# Altium schematic sheet SW_S_5.SchDoc
size Tabloid
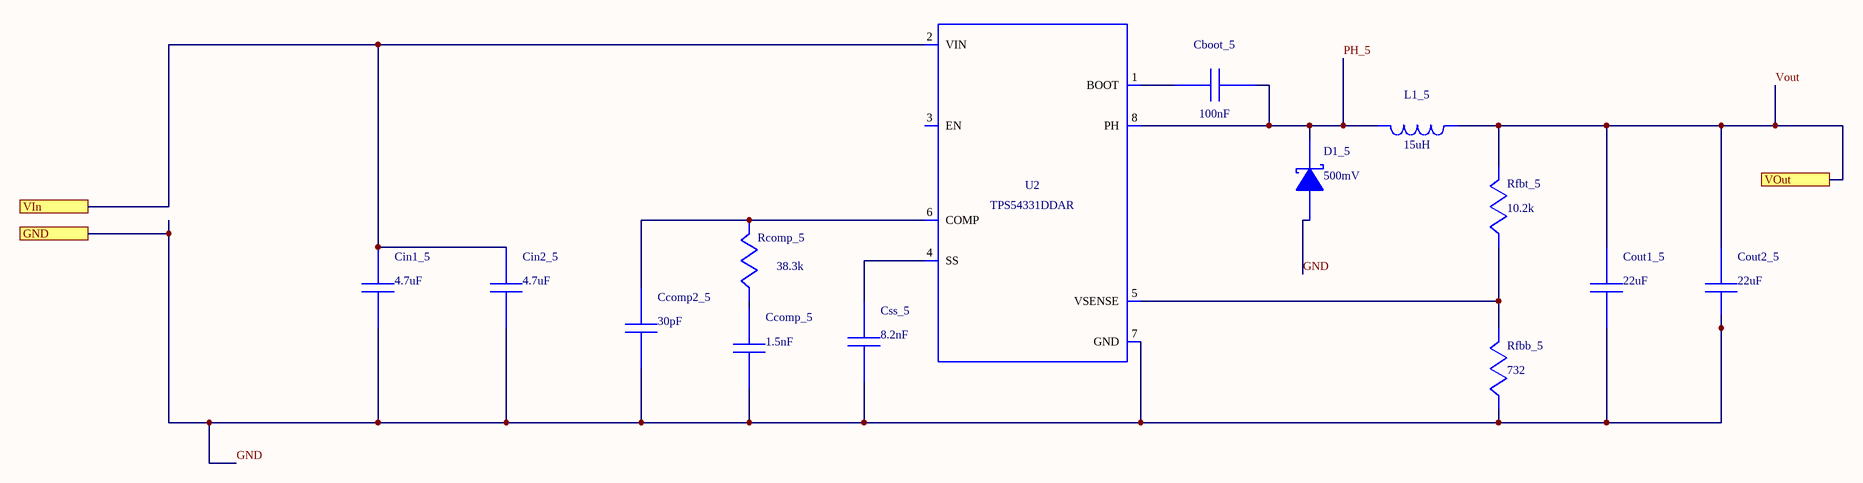
[diagram p0: SW_S_5.SchDoc]

## Parts
Cboot_5  value 100nF  [1608[0603]]  (hidden comment: C1608X7R1E104K)
Ccomp2_5  value 30pF  [6-0805_M]  (hidden comment: CL21C300JBANNNC)
Ccomp_5  value 1.5nF  [6-0805_M]  (hidden comment: CC0805KRX7R9BB152)
Cin1_5  value 4.7uF  [C1210_M]  (hidden comment: GRM32ER71H475KA88L)
Cin2_5  value 4.7uF  [C1210_M]  (hidden comment: GRM32ER71H475KA88L)
Cout1_5  value 22uF  [C1210_M]  (hidden comment: GRM32ER61E226KE15L)
Cout2_5  value 22uF  [C1210_M]  (hidden comment: GRM32ER61E226KE15L)
Css_5  value 8.2nF  [1608[0603]]  (hidden comment: GRM188R71E822KA01D)
D1_5  value 500mV  [SMA Diode Package]  (hidden comment: B340A-13-F)
L1_5  value 15uH  [SRR1260]  (hidden comment: SRR1260-150M)
Rcomp_5  value 38.3k  [6-0805_M]  (hidden comment: CRCW080538K3FKEA)
Rfbb_5  value 732  [6-0805_M]  (hidden comment: CRCW0805732RFKEA)
Rfbt_5  value 10.2k  [6-0805_M]  (hidden comment: CRCW080510K2FKEA)
U2  TPS54331DDAR  [TI-D8_N]

## Ports
GND, VIn, VOut

## Nets
GND: Ccomp2_5.2 Ccomp_5.2 Cin1_5.2 Cin2_5.2 Cout1_5.2 Cout2_5.2 Css_5.2 D1_5.2(A) Rfbb_5.2 U2.7(GND) ; port GND
PH_5: Cboot_5.2 D1_5.1(K) L1_5.1 U2.8(PH)
VIn: Cin1_5.1 Cin2_5.1 U2.2(VIN) ; port VIn
Vout: Cout1_5.1 Cout2_5.1 L1_5.2 Rfbt_5.1 ; port VOut
NetCboot_5_1: Cboot_5.1 U2.1(BOOT)
NetCcomp2_5_1: Ccomp2_5.1 Rcomp_5.1 U2.6(COMP)
NetCcomp_5_1: Ccomp_5.1 Rcomp_5.2
NetCss_5_1: Css_5.1 U2.4(SS)
NetRfbb_5_1: Rfbb_5.1 Rfbt_5.2 U2.5(VSENSE)

Not connected (* = marked no-connect by the designer): U2 3(EN)

## Library data of the parts
Cboot_5 = C1608X7R1E104K: Manufacturer Name: TDK; PackageReference: C1608X7R1E104K; Manufacturer Part Number: C1608X7R1E104K
Ccomp2_5 = CL21C300JBANNNC: Manufacturer Name: Samsung Electro-Mechanics; PackageReference: CL21C300JBANNNC; Manufacturer Part Number: CL21C300JBANNNC
Ccomp_5 = CC0805KRX7R9BB152: CC0805KRX7R9BB15; Manufacturer Name: Yageo America; PackageReference: CC0805KRX7R9BB152; Manufacturer Part Number: CC0805KRX7R9BB152
Cin1_5 Cin2_5 = GRM32ER71H475KA88L: GRM32ER71H475KA8; Manufacturer Name: MuRata; PackageReference: GRM32ER71H475KA88L; Manufacturer Part Number: GRM32ER71H475KA88L
Cout1_5 Cout2_5 = GRM32ER61E226KE15L: GRM32ER61E226KE1; Manufacturer Name: MuRata; PackageReference: GRM32ER61E226KE15L; Manufacturer Part Number: GRM32ER61E226KE15L
Css_5 = GRM188R71E822KA01D: GRM188R71E822KA0; Manufacturer Name: MuRata; PackageReference: GRM188R71E822KA01D; Manufacturer Part Number: GRM188R71E822KA01D
D1_5 = B340A-13-F: Manufacturer Name: Diodes Inc.; PackageReference: B340A-13-F; Manufacturer Part Number: B340A-13-F
L1_5 = SRR1260-150M: Manufacturer Name: Bourns; PackageReference: SRR1260-150M; Manufacturer Part Number: SRR1260-150M
Rcomp_5 = CRCW080538K3FKEA: Manufacturer Name: Vishay-Dale; PackageReference: CRCW080538K3FKEA; Manufacturer Part Number: CRCW080538K3FKEA
Rfbb_5 = CRCW0805732RFKEA: Manufacturer Name: Vishay-Dale; PackageReference: CRCW0805732RFKEA; Manufacturer Part Number: CRCW0805732RFKEA
Rfbt_5 = CRCW080510K2FKEA: Manufacturer Name: Vishay-Dale; PackageReference: CRCW080510K2FKEA; Manufacturer Part Number: CRCW080510K2FKEA
U2 = TPS54331DDAR: Manufacturer Name: Texas Instruments; Value: UNLISTED; PackageReference: TPS54331DDAR; Manufacturer Part Number: TPS54331DDAR